# Altium project Charger.PrjPCB
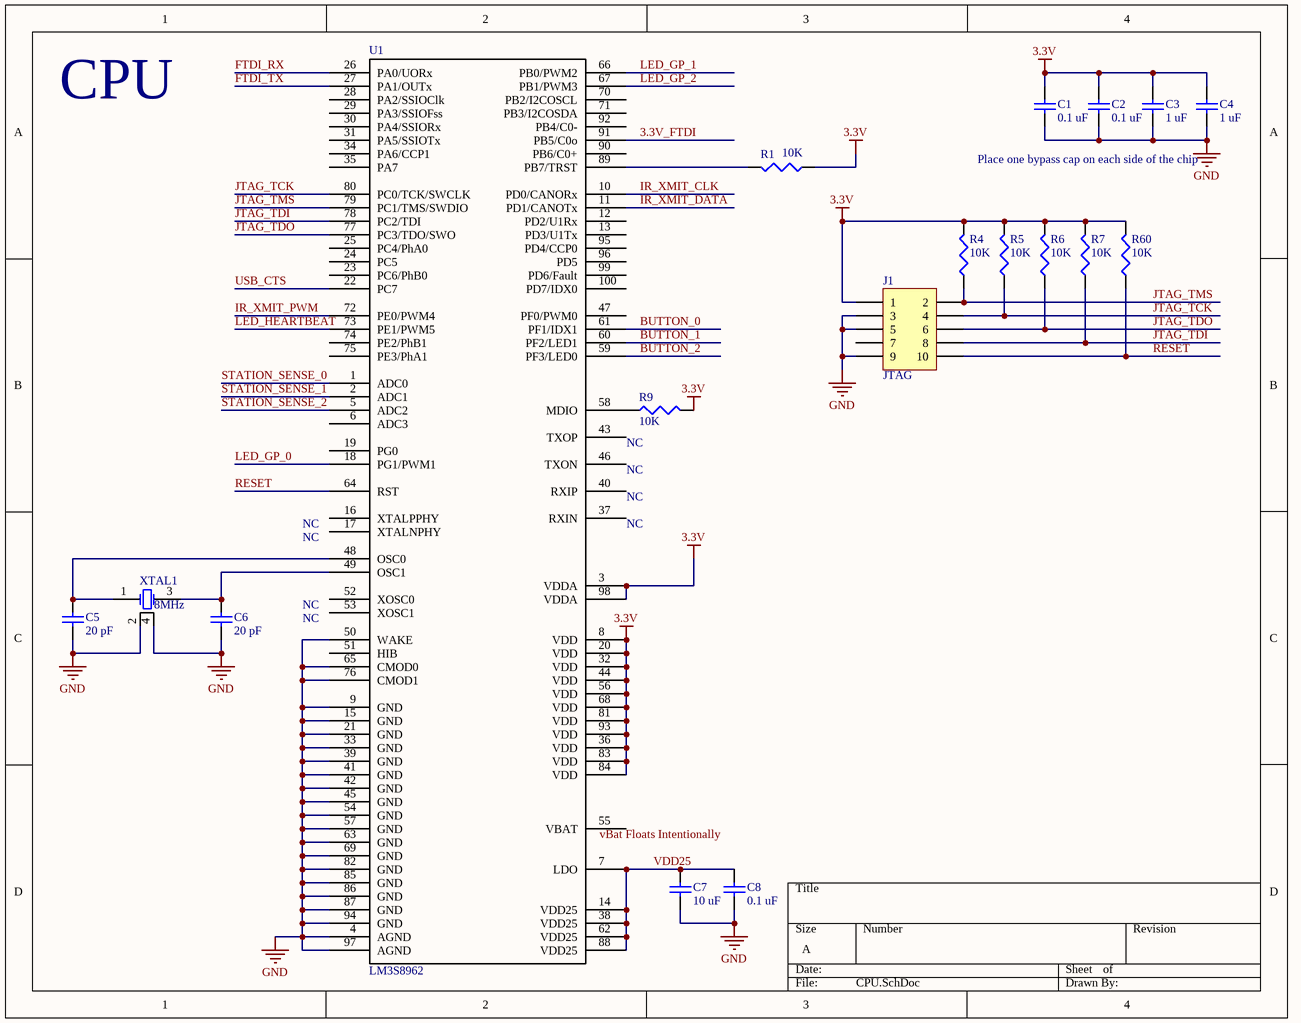
[diagram p0: CPU.SchDoc]
5 sheets, 95 parts. Net scope: global (net labels, ports and power ports of the same name join across sheets).
Board file: Charger.PcbDoc
Sheets:
  CPU.SchDoc
  IRComms.SchDoc
  LEDsAndButtons.SchDoc
  USBHeaders.SchDoc
  PowerAndSense.SchDoc

## Sheet CPU.SchDoc
size A; PageSetup: Record=PageOptions|CenterHorizontal=True|CenterVertical=True|PrintScale=1.05|XCorrection=1.00|YCorrection=1.00|PrintKind=1|BorderSize=5000000|LeftOffset=0|BottomOffset=0|Orientation=2|PaperLength=1000|PaperWidth=1000|Scale=100|PaperSource=262|PrintQuality=600|MediaType=1|DitherType=10|PaperKind=Letter|PrintScaleMode=1

### Parts
C1  value 0.1 uF  [CAPC1005L]
C2  value 0.1 uF  [CAPC1005L]
C3  value 1 uF  [CAPC1608L]
C4  value 1 uF  [CAPC1608L]
C5  value 20 pF  [CAPC1005L]
C6  value 20 pF  [CAPC1005L]
C7  value 10 uF  [CAPC1608L]
C8  value 0.1 uF  [CAPC1005L]
J1  JTAG  [JTAG-10]
R1  value 10K  [RESC1608L]  (hidden comment: Res3)
R4  value 10K  [RESC1608L]  (hidden comment: Res3)
R5  value 10K  [RESC1608L]  (hidden comment: Res3)
R6  value 10K  [RESC1608L]  (hidden comment: Res3)
R7  value 10K  [RESC1608L]  (hidden comment: Res3)
R9  value 10K  [RESC1608L]  (hidden comment: Res3)
R60  value 10K  [RESC1608L]  (hidden comment: Res3)
U1  LM3S8962  [LQFP-100]
XTAL1  8MHz  [CRYSTAL]

### Nets
3.3V: C1.2 C2.2 C3.2 C4.2 J1.1 R1.1 R4.2 R5.2 R6.2 R7.2 R9.2 R60.2 U1.3(VDDA) U1.8(VDD) U1.20(VDD) U1.32(VDD) U1.36(VDD) U1.44(VDD) U1.56(VDD) U1.68(VDD) U1.81(VDD) U1.83(VDD) U1.84(VDD) U1.93(VDD) U1.98(VDDA)
3.3V_FTDI: U1.91(PB5/C0o)
GND: C1.1 C2.1 C3.1 C4.1 C5.1 C6.1 C7.1 C8.1 J1.3 J1.5 J1.9 U1.4(AGND) U1.9(GND) U1.15(GND) U1.21(GND) U1.33(GND) U1.39(GND) U1.41(GND) U1.42(GND) U1.45(GND) U1.50(WAKE) U1.54(GND) U1.57(GND) U1.63(GND) U1.65(CMOD0) U1.69(GND) U1.76(CMOD1) U1.82(GND) U1.85(GND) U1.86(GND) U1.87(GND) U1.94(GND) U1.97(AGND) XTAL1.2(GND) XTAL1.4(GND)
BUTTON_0: U1.61(PF1/IDX1)
BUTTON_1: U1.60(PF2/LED1)
BUTTON_2: U1.59(PF3/LED0)
FTDI_RX: U1.26(PA0/UORx)
FTDI_TX: U1.27(PA1/OUTx)
IR_XMIT_CLK: U1.10(PD0/CANORx)
IR_XMIT_DATA: U1.11(PD1/CANOTx)
IR_XMIT_PWM: U1.72(PE0/PWM4)
JTAG_TCK: J1.4 R5.1 U1.80(PC0/TCK/SWCLK)
JTAG_TDI: J1.8 R7.1 U1.78(PC2/TDI)
JTAG_TDO: J1.6 R6.1 U1.77(PC3/TDO/SWO)
JTAG_TMS: J1.2 R4.1 U1.79(PC1/TMS/SWDIO)
LED_GP_0: U1.18(PG1/PWM1)
LED_GP_1: U1.66(PB0/PWM2)
LED_GP_2: U1.67(PB1/PWM3)
LED_HEARTBEAT: U1.73(PE1/PWM5)
RESET: J1.10 R60.1 U1.64(RST)
STATION_SENSE_0: U1.1(ADC0)
STATION_SENSE_1: U1.2(ADC1)
STATION_SENSE_2: U1.5(ADC2)
USB_CTS: U1.22(PC7)
VDD25: C7.2 C8.2 U1.7(LDO) U1.14(VDD25) U1.38(VDD25) U1.62(VDD25) U1.88(VDD25)
NetC5_2: C5.2 U1.48(OSC0) XTAL1.1(OSC1)
NetC6_2: C6.2 U1.49(OSC1) XTAL1.3(OSC2)
NetR1_2: R1.2 U1.89(PB7/TRST)
NetR9_1: R9.1 U1.58(MDIO)

Not connected (* = marked no-connect by the designer): J1 7; U1 6(ADC3) 12(PD2/U1Rx) 13(PD3/U1Tx) 16(XTALPPHY) 17(XTALNPHY) 19(PG0) 23(PC6/PhB0) 24(PC5) 25(PC4/PhA0) 28(PA2/SSIOClk) 29(PA3/SSIOFss) 30(PA4/SSIORx) 31(PA5/SSIOTx) 34(PA6/CCP1) 35(PA7) 37(RXIN) 40(RXIP) 43(TXOP) 46(TXON) 47(PF0/PWM0) 51(HIB) 52(XOSC0) 53(XOSC1) 55(VBAT) 70(PB2/I2COSCL) 71(PB3/I2COSDA) 74(PE2/PhB1) 75(PE3/PhA1) 90(PB6/C0+) 92(PB4/C0-) 95(PD4/CCP0) 96(PD5) 99(PD6/Fault) 100(PD7/IDX0)

### Notes on the sheet
- CPU
- Place one bypass cap on each side of the chip
- NC
- (near U1) NC
- (near U1) vBat Floats Intentionally

### Library data of the parts
C1-C8 = Cap: Capacitor; Published: 8-Jun-2000; LatestRevisionDate: 17-Jul-2002; LatestRevisionNote: Re-released for DXP Platform.; PackageReference: RAD-0.3; Publisher: Altium Limited
J1 = Header 5X2H: Header, 5-Pin, Dual row, Right Angle; LatestRevisionDate: 17-Jul-2002; LatestRevisionNote: Re-released for DXP Platform.; Publisher: Altium Limited
R1 R4-R7 R9 R60 = Res3: Resistor; Published: 8-Jun-2000; LatestRevisionDate: 29-May-2009; LatestRevisionNote: IPC-7351 Footprint Added.; PackageReference: J1-0603; Publisher: Altium Limited; PackageDescription: Chip Resistor
XTAL1 = Crystal

## Sheet IRComms.SchDoc
size A
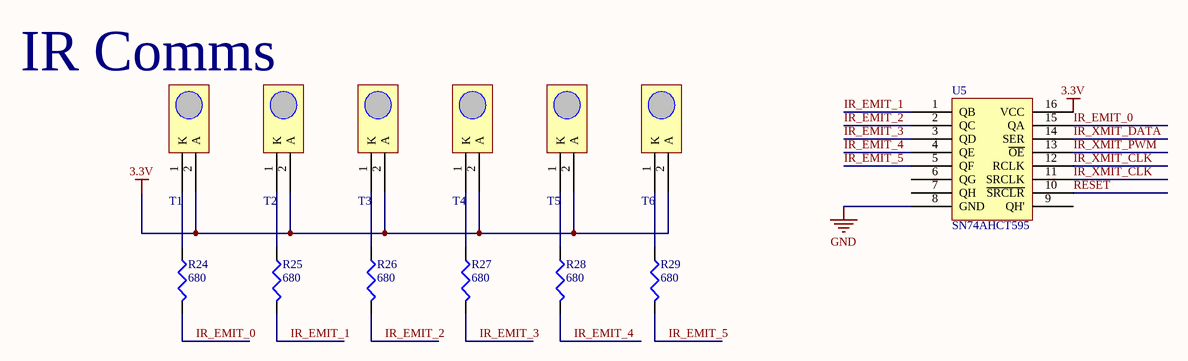
[diagram p1: IRComms.SchDoc]

### Parts
R24  value 680  [RESC1608L]  (hidden comment: Res3)
R25  value 680  [RESC1608L]  (hidden comment: Res3)
R26  value 680  [RESC1608L]  (hidden comment: Res3)
R27  value 680  [RESC1608L]  (hidden comment: Res3)
R28  value 680  [RESC1608L]  (hidden comment: Res3)
R29  value 680  [RESC1608L]  (hidden comment: Res3)
T1  LN54  [LN54]  (value not drawn)
T2  LN54  [LN54]  (value not drawn)
T3  LN54  [LN54]  (value not drawn)
T4  LN54  [LN54]  (value not drawn)
T5  LN54  [LN54]  (value not drawn)
T6  LN54  [LN54]  (value not drawn)
U5  SN74AHCT595  [TSSOP-16]

### Nets
3.3V: T1.2(A) T2.2(A) T3.2(A) T4.2(A) T5.2(A) T6.2(A) U5.16(VCC)
GND: U5.8(GND)
IR_EMIT_0: R24.2 U5.15(QA)
IR_EMIT_1: R25.2 U5.1(QB)
IR_EMIT_2: R26.2 U5.2(QC)
IR_EMIT_3: R27.2 U5.3(QD)
IR_EMIT_4: R28.2 U5.4(QE)
IR_EMIT_5: R29.2 U5.5(QF)
IR_XMIT_CLK: U5.11(SRCLK) U5.12(RCLK)
IR_XMIT_DATA: U5.14(SER)
IR_XMIT_PWM: U5.13(~{OE})
RESET: U5.10(~{SRCLR})
NetR24_1: R24.1 T1.1(K)
NetR25_1: R25.1 T2.1(K)
NetR26_1: R26.1 T3.1(K)
NetR27_1: R27.1 T4.1(K)
NetR28_1: R28.1 T5.1(K)
NetR29_1: R29.1 T6.1(K)

Not connected (* = marked no-connect by the designer): U5 6(QG) 7(QH) 9(QH')

### Notes on the sheet
- IR Comms

### Library data of the parts
R24-R29 = Res3: Resistor; Published: 8-Jun-2000; LatestRevisionDate: 29-May-2009; LatestRevisionNote: IPC-7351 Footprint Added.; PackageReference: J1-0603; Publisher: Altium Limited; PackageDescription: Chip Resistor
U5 = SN74AHCT595: shift register

## Sheet LEDsAndButtons.SchDoc
size A
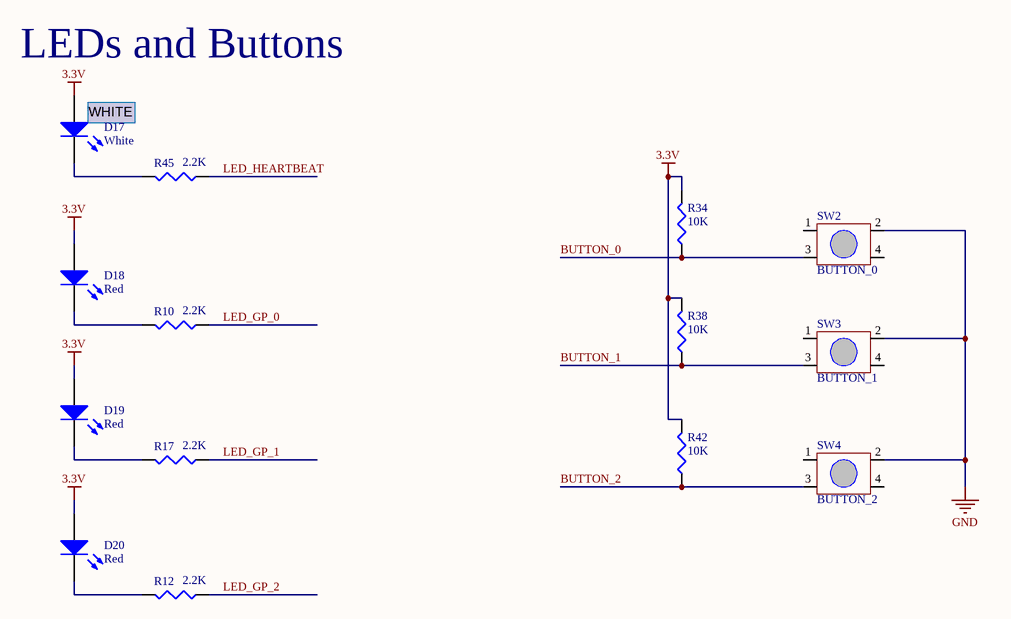
[diagram p2: LEDsAndButtons.SchDoc]

### Parts
D17  White  [SurfaceMount(603)]
D18  Red  [SurfaceMount(603)]
D19  Red  [SurfaceMount(603)]
D20  Red  [SurfaceMount(603)]
R10  value 2.2K  [RESC1608L]  (hidden comment: Res3)
R12  value 2.2K  [RESC1608L]  (hidden comment: Res3)
R17  value 2.2K  [RESC1608L]  (hidden comment: Res3)
R34  value 10K  [RESC1608L]  (hidden comment: Res3)
R38  value 10K  [RESC1608L]  (hidden comment: Res3)
R42  value 10K  [RESC1608L]  (hidden comment: Res3)
R45  value 2.2K  [RESC1608L]  (hidden comment: Res3)
SW2  BUTTON_0  [SwitchTall-TL330]
SW3  BUTTON_1  [SwitchTall-TL330]
SW4  BUTTON_2  [SwitchTall-TL330]

### Nets
3.3V: D17.1(A) D18.1(A) D19.1(A) D20.1(A) R34.2 R38.2 R42.2
GND: SW2.2 SW3.2 SW4.2
BUTTON_0: R34.1 SW2.3
BUTTON_1: R38.1 SW3.3
BUTTON_2: R42.1 SW4.3
LED_GP_0: R10.1
LED_GP_1: R17.1
LED_GP_2: R12.1
LED_HEARTBEAT: R45.1
NetD17_2: D17.2(K) R45.2
NetD18_2: D18.2(K) R10.2
NetD19_2: D19.2(K) R17.2
NetD20_2: D20.2(K) R12.2

Not connected (* = marked no-connect by the designer): SW2 1 4; SW3 1 4; SW4 1 4

### Notes on the sheet
- LEDs and Buttons
- (near D17) WHITE

### Library data of the parts
D17-D20 = LED
R10 R12 R17 R34 R38 R42 R45 = Res3: Resistor; Published: 8-Jun-2000; LatestRevisionDate: 29-May-2009; LatestRevisionNote: IPC-7351 Footprint Added.; PackageReference: J1-0603; Publisher: Altium Limited; PackageDescription: Chip Resistor
SW2-SW4 = Switch-TL330

## Sheet USBHeaders.SchDoc
size A
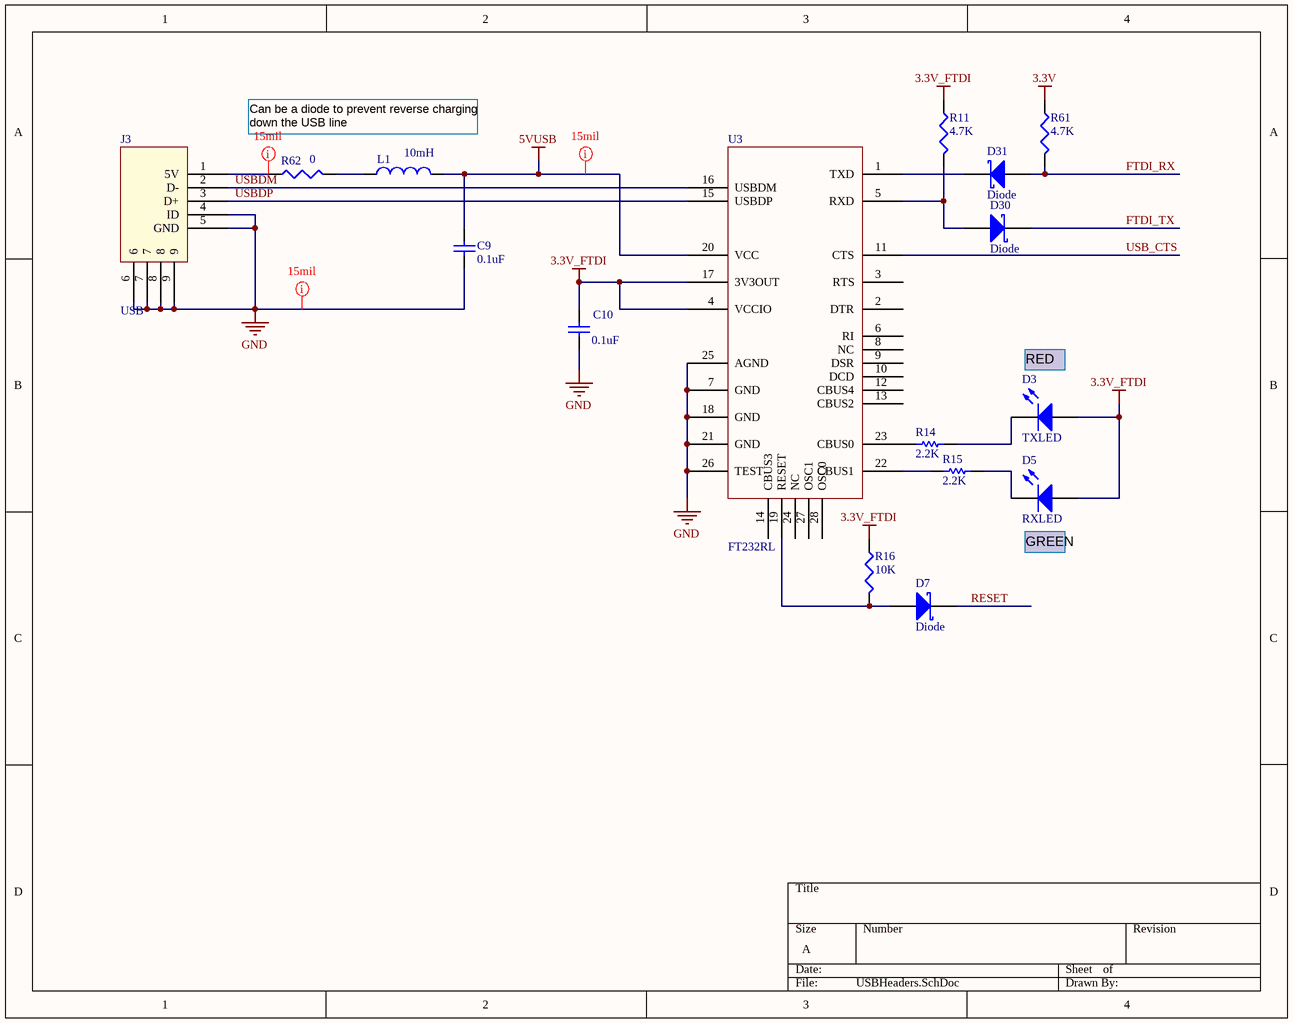
[diagram p3: USBHeaders.SchDoc]

### Parts
C9  value 0.1uF  [CAPC1005L]
C10  value 0.1uF  [CAPC1005L]
D3  TXLED  [SurfaceMount(603)]
D5  RXLED  [SurfaceMount(603)]
D7  Diode  [SurfaceMount(603)]
D30  Diode  [SurfaceMount(603)]
D31  Diode  [SurfaceMount(603)]
J3  USB  [USB Minib (thru-hole)]
L1  value 10mH  [INDC2012L]  (hidden comment: Inductor)
R11  value 4.7K  [RESC1608L]  (hidden comment: Res3)
R14  value 2.2K  [RESC1608L]
R15  value 2.2K  [RESC1608L]
R16  value 10K  [RESC1608L]  (hidden comment: Res3)
R61  value 4.7K  [RESC1608L]  (hidden comment: Res3)
R62  value 0  [RESC1608L]  (hidden comment: Res3)
U3  FT232RL  [SSOP-28]

### Nets
3.3V: R61.1
3.3V_FTDI: C10.2 D3.1(A) D5.1(A) R11.1 R16.1 U3.4(VCCIO) U3.17(3V3OUT)
5VUSB: C9.2 L1.2 U3.20(VCC)
GND: C9.1 C10.1 J3.4(ID) J3.5(GND) J3.6 J3.7 J3.8 J3.9 U3.7(GND) U3.18(GND) U3.21(GND) U3.25(AGND) U3.26(TEST)
FTDI_RX: D31.2(A) R61.2
FTDI_TX: D30.1(K)
RESET: D7.1(K)
USB_CTS: U3.11(CTS)
USBDM: J3.2(D-) U3.16(USBDM)
USBDP: J3.3(D+) U3.15(USBDP)
NetD3_2: D3.2(K) R14.2
NetD5_2: D5.2(K) R15.2
NetD7_2: D7.2(A) R16.2 U3.19(RESET)
NetD30_2: D30.2(A) R11.2 U3.5(RXD)
NetD31_1: D31.1(K) U3.1(TXD)
NetJ3_1: J3.1(5V) R62.1
NetL1_1: L1.1 R62.2
NetR14_1: R14.1 U3.23(CBUS0)
NetR15_1: R15.1 U3.22(CBUS1)

Not connected (* = marked no-connect by the designer): U3 2(DTR) 3(RTS) 6(RI) 8(NC) 9(DSR) 10(DCD) 12(CBUS4) 13(CBUS2) 14(CBUS3) 24(NC) 27(OSC1) 28(OSC0)

### Layout directives
rule Width Constraint [Pref Width = 8mil    Min Width = 8mil    Max Width = 15mil]: 5VUSB, GND, NetJ3_1

### Notes on the sheet
- Can be a diode to prevent reverse charging down the USB line
- (near D3) RED
- (near D5) GREEN

### Library data of the parts
C9 C10 = Cap: Capacitor; Published: 8-Jun-2000; LatestRevisionDate: 17-Jul-2002; LatestRevisionNote: Re-released for DXP Platform.; PackageReference: RAD-0.3; Publisher: Altium Limited
D3 D5 = LED2: Typical RED, GREEN, YELLOW, AMBER GaAs LED; Published: 8-Jun-2000; LatestRevisionDate: 17-Jul-2002; LatestRevisionNote: Re-released for DXP Platform.; PackageVersion: Feb-2002; PackageReference: 3.2X1.6X1.1; Publisher: Altium Limited
D7 D30 D31 = SchottkeyDiode
J3 = USB-ConnTH
L1 = Inductor: Code_IEC: 1005; Published: 8-Jun-2000; LatestRevisionDate: 29-May-2009; LatestRevisionNote: IPC-7351 Footprint Added.; PackageReference: 0402-A; Publisher: Altium Limited; PackageDescription: Chip Inductor; Code_JEITA: 0402
R11 R16 R61 R62 = Res3: Resistor; Published: 8-Jun-2000; LatestRevisionDate: 29-May-2009; LatestRevisionNote: IPC-7351 Footprint Added.; PackageReference: J1-0603; Publisher: Altium Limited; PackageDescription: Chip Resistor
R14 R15 = Res1: Resistor; Published: 8-Jun-2000; LatestRevisionDate: 17-Jul-2002; LatestRevisionNote: Re-released for DXP Platform.; PackageReference: AXIAL-0.3; Publisher: Altium Limited

## Sheet PowerAndSense.SchDoc
size A
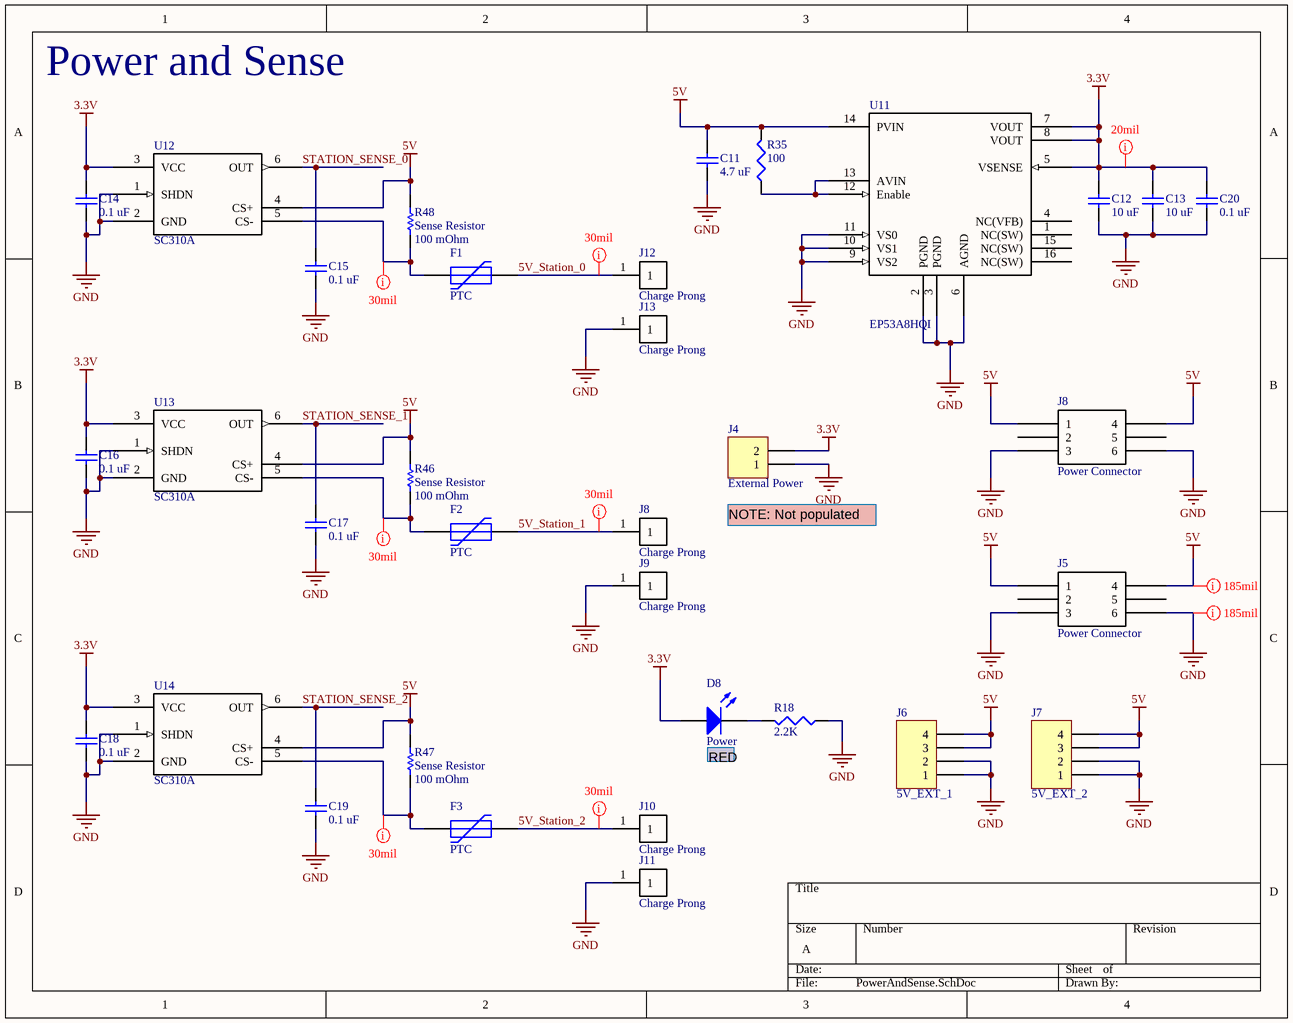
[diagram p4: PowerAndSense.SchDoc]

### Parts
(Parts that share a designator on the sheet are numbered #1, #2 ... from top to bottom, then left to right.)
C11  value 4.7 uF  [CAPC1608L]
C12  value 10 uF  [CAPC2012L]
C13  value 10 uF  [CAPC2012L]
C14  value 0.1 uF  [CAPC1005L]
C15  value 0.1 uF  [CAPC1005L]
C16  value 0.1 uF  [CAPC1005L]
C17  value 0.1 uF  [CAPC1005L]
C18  value 0.1 uF  [CAPC1005L]
C19  value 0.1 uF  [CAPC1005L]
C20  value 0.1 uF  [CAPC1005L]
D8  Power  [SurfaceMount(603)]
F1  PTC  [ERJ8G-1206]
F2  PTC  [ERJ8G-1206]
F3  PTC  [ERJ8G-1206]
J4  External Power  [HDR1X2]
J5  Power Connector  [MOLEX_MINI-FIT_JR_5569_2X3_HORIZ]
J6  5V_EXT_1  [HDR1X4]
J7  5V_EXT_2  [HDR1X4]
J8#1  Power Connector  [MOLEX_MINI-FIT_JR_5569_2X3_HORIZ]
J8#2  Charge Prong  [CHARGING_PRONG]
J9  Charge Prong  [CHARGING_PRONG]
J10  Charge Prong  [CHARGING_PRONG]
J11  Charge Prong  [CHARGING_PRONG]
J12  Charge Prong  [CHARGING_PRONG]
J13  Charge Prong  [CHARGING_PRONG]
R18  value 2.2K  [RESC1608L]  (hidden comment: Res3)
R35  value 100  [RESC1608L]  (hidden comment: Res3)
R46  Sense Resistor  value 100 mOhm  [ERJ8G-1206]
R47  Sense Resistor  value 100 mOhm  [ERJ8G-1206]
R48  Sense Resistor  value 100 mOhm  [ERJ8G-1206]
U11  EP53A8HQI  [QFN-16 - EP53A8xQI Package]
U12  SC310A  [SOT-23-6]
U13  SC310A  [SOT-23-6]
U14  SC310A  [SOT-23-6]

### Nets
3.3V: C12.2 C13.2 C14.2 C16.2 C18.2 C20.2 D8.1(A) J4.2 U11.5(VSENSE) U11.7(VOUT) U11.8(VOUT) U12.3(VCC) U13.3(VCC) U14.3(VCC)
5V: C11.2 J5.1 J5.4 J6.3 J6.4 J7.3 J7.4 J8#1.1 J8#1.4 R35.2 R46.2 R47.2 R48.2 U11.14(PVIN) U12.4(CS+) U13.4(CS+) U14.4(CS+)
GND: C11.1 C12.1 C13.1 C14.1 C15.1 C16.1 C17.1 C18.1 C19.1 C20.1 J4.1 J5.3 J5.6 J6.1 J6.2 J7.1 J7.2 J8#1.3 J8#1.6 J9.1 J11.1 J13.1 R18.1 U11.2(PGND) U11.3(PGND) U11.6(AGND) U11.9(VS2) U11.10(VS1) U11.11(VS0) U12.1(SHDN) U12.2(GND) U13.1(SHDN) U13.2(GND) U14.1(SHDN) U14.2(GND)
5V_Station_0: F1.2 J12.1
5V_Station_1: F2.2 J8#2.1
5V_Station_2: F3.2 J10.1
STATION_SENSE_0: C15.2 U12.6(OUT)
STATION_SENSE_1: C17.2 U13.6(OUT)
STATION_SENSE_2: C19.2 U14.6(OUT)
NetD8_2: D8.2(K) R18.2
NetF1_1: F1.1 R48.1 U12.5(CS-)
NetF2_1: F2.1 R46.1 U13.5(CS-)
NetF3_1: F3.1 R47.1 U14.5(CS-)
NetR35_1: R35.1 U11.12(Enable) U11.13(AVIN)

Not connected (* = marked no-connect by the designer): J5 2 5; J8#1 2 5; U11 1(NC(SW)) 4(NC(VFB)) 15(NC(SW)) 16(NC(SW))

### Layout directives
rule Width Constraint [Pref Width = 50mil    Min Width = 8mil    Max Width = 185mil]: GND
rule Width Constraint [Pref Width = 185mil    Min Width = 8mil    Max Width = 250mil]: 5V
rule Width Constraint [Pref Width = 30mil    Min Width = 15mil    Max Width = 100mil]: 5V_Station_0, 5V_Station_1, 5V_Station_2
rule Width Constraint [Pref Width = 20mil    Min Width = 8mil    Max Width = 100mil]: 3.3V
rule Width Constraint [Pref Width = 30mil    Min Width = 8mil    Max Width = 100mil]: NetF1_1, NetF2_1, NetF3_1

### Notes on the sheet
- Power and Sense
- (near J4) NOTE: Not populated
- (near D8) RED

### Library data of the parts
C11-C20 = Cap: Capacitor; Published: 8-Jun-2000; LatestRevisionDate: 17-Jul-2002; LatestRevisionNote: Re-released for DXP Platform.; PackageReference: RAD-0.3; Publisher: Altium Limited
D8 = LED
F1-F3 = PTC_FUSE: Fuse; Published: 8-Jun-2000; LatestRevisionDate: 17-Jul-2002; LatestRevisionNote: Re-released for DXP Platform.; PackageReference: PIN-W2/E2.8; Publisher: Altium Limited
J4 = Header 2: Header, 2-Pin; LatestRevisionDate: 17-Jul-2002; LatestRevisionNote: Re-released for DXP Platform.; Publisher: Altium Limited
J5 J8#1 = MOLEX_MINI_FIT_JR_2X3
J6 J7 = Header 4: Header, 4-Pin; LatestRevisionDate: 17-Jul-2002; LatestRevisionNote: Re-released for DXP Platform.; Publisher: Altium Limited
J8#2 J9-J13 = CHARGE_PRONG: Charging Prong Hole with Plating
R18 R35 = Res3: Resistor; Published: 8-Jun-2000; LatestRevisionDate: 29-May-2009; LatestRevisionNote: IPC-7351 Footprint Added.; PackageReference: J1-0603; Publisher: Altium Limited; PackageDescription: Chip Resistor
R46-R48 = Resistor: Published: 8-Jun-2000; LatestRevisionDate: 17-Jul-2002; LatestRevisionNote: Re-released for DXP Platform.; PackageReference: AXIAL-0.3; Publisher: Altium Limited; PackageDescription: Axial Device, Thru-Hole; 2 Leads; 0.3 in Pin Spacing
U11 = EP53A8HQI: DC/DC Converter with Integrated Inductor
U12-U14 = SC310A: High-Side Current-Sense Amplifier with Low Impedance Voltage Output

## Nets that join several sheets
3.3V: CPU (25 pins), IRComms (7 pins), LEDsAndButtons (7 pins), USBHeaders (R61.1), PowerAndSense (14 pins)
3.3V_FTDI: CPU (U1.91), USBHeaders (7 pins)
GND: CPU (35 pins), IRComms (U5.8), LEDsAndButtons (SW2.2 SW3.2 SW4.2), USBHeaders (13 pins), PowerAndSense (35 pins)
BUTTON_0: CPU (U1.61), LEDsAndButtons (R34.1 SW2.3)
BUTTON_1: CPU (U1.60), LEDsAndButtons (R38.1 SW3.3)
BUTTON_2: CPU (U1.59), LEDsAndButtons (R42.1 SW4.3)
FTDI_RX: CPU (U1.26), USBHeaders (D31.2 R61.2)
FTDI_TX: CPU (U1.27), USBHeaders (D30.1)
IR_XMIT_CLK: CPU (U1.10), IRComms (U5.11 U5.12)
IR_XMIT_DATA: CPU (U1.11), IRComms (U5.14)
IR_XMIT_PWM: CPU (U1.72), IRComms (U5.13)
LED_GP_0: CPU (U1.18), LEDsAndButtons (R10.1)
LED_GP_1: CPU (U1.66), LEDsAndButtons (R17.1)
LED_GP_2: CPU (U1.67), LEDsAndButtons (R12.1)
LED_HEARTBEAT: CPU (U1.73), LEDsAndButtons (R45.1)
RESET: CPU (J1.10 R60.1 U1.64), IRComms (U5.10), USBHeaders (D7.1)
STATION_SENSE_0: CPU (U1.1), PowerAndSense (C15.2 U12.6)
STATION_SENSE_1: CPU (U1.2), PowerAndSense (C17.2 U13.6)
STATION_SENSE_2: CPU (U1.5), PowerAndSense (C19.2 U14.6)
USB_CTS: CPU (U1.22), USBHeaders (U3.11)